# Altium schematic sheet USBC_Hub2.SchDoc
size A3; SheetNumber: 1; SheetTotal: 4
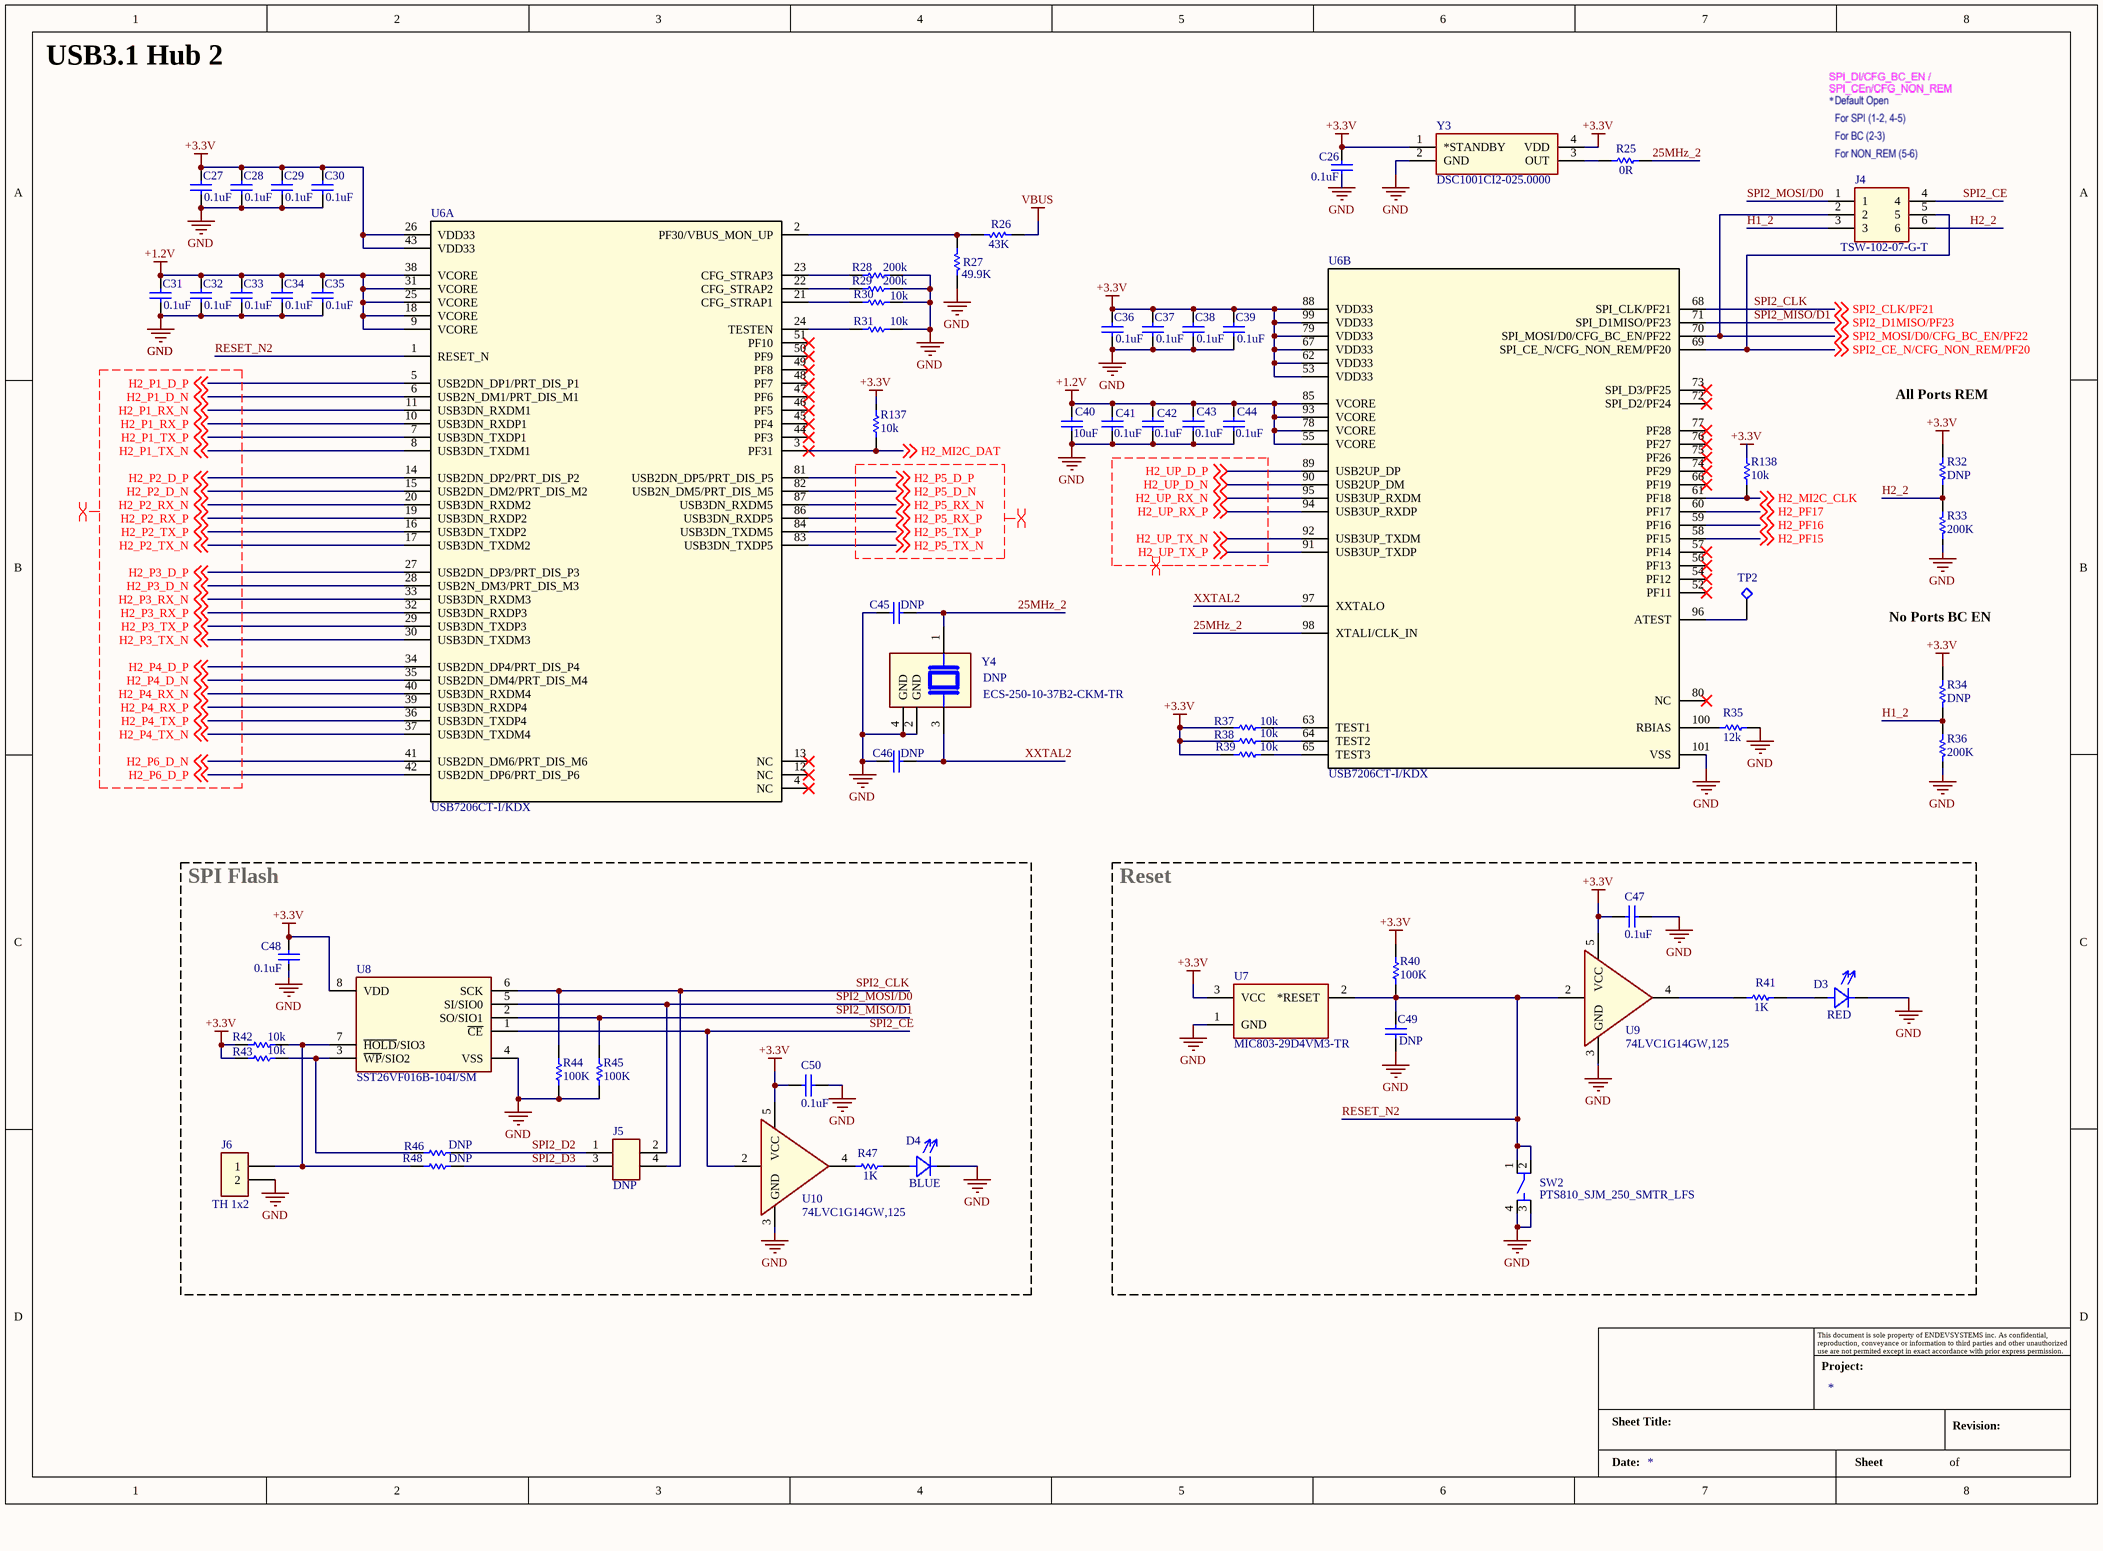
[diagram p0: USBC_Hub2.SchDoc]

## Parts
?  Title_Block  (value not drawn)  (graphical)
C26  0.1uF  [C-0402/1005]
C27  0.1uF  [C-0402/1005]
C28  0.1uF  [C-0402/1005]
C29  0.1uF  [C-0402/1005]
C30  0.1uF  [C-0402/1005]
C31  0.1uF  [C-0402/1005]
C32  0.1uF  [C-0402/1005]
C33  0.1uF  [C-0402/1005]
C34  0.1uF  [C-0402/1005]
C35  0.1uF  [C-0402/1005]
C36  0.1uF  [C-0402/1005]
C37  0.1uF  [C-0402/1005]
C38  0.1uF  [C-0402/1005]
C39  0.1uF  [C-0402/1005]
C40  10uF  [C-0805/2012]
C41  0.1uF  [C-0402/1005]
C42  0.1uF  [C-0402/1005]
C43  0.1uF  [C-0402/1005]
C44  0.1uF  [C-0402/1005]
C45  DNP  [R-0402/1005]
C46  DNP  [R-0402/1005]
C47  0.1uF  [C-0402/1005]
C48  0.1uF  [C-0402/1005]
C49  value DNP  [C-0402/1005]  (hidden comment: 0.1uF)
C50  0.1uF  [C-0402/1005]
D3  RED  [LEDC1608X65N]
D4  BLUE  [LEDC1608X65N]
J4  TSW-102-07-G-T  [CON6_3X2_TU_TSW_SAI]
J5  DNP  [PIN HEADER 2x2 2.54mm]
J6  TH 1x2  [PIN HEADER 1x2 2.54mm]
R25  0R  [R-0402/1005]
R26  43K  [R-0402/1005]
R27  49.9K  [R-0402/1005]
R28  200k  [R-0402/1005]
R29  200k  [R-0402/1005]
R30  10k  [R-0402/1005]
R31  10k  [R-0402/1005]
R32  DNP  [R-0402/1005]
R33  200K  [R-0402/1005]
R34  DNP  [R-0402/1005]
R35  12k  [R-0402/1005]
R36  200K  [R-0402/1005]
R37  10k  [R-0402/1005]
R38  10k  [R-0402/1005]
R39  10k  [R-0402/1005]
R40  100K  [R-0402/1005]
R41  1K  [R-0402/1005]
R42  10k  [R-0402/1005]
R43  10k  [R-0402/1005]
R44  100K  [R-0402/1005]
R45  100K  [R-0402/1005]
R46  DNP  [R-0402/1005]
R47  1K  [R-0402/1005]
R48  DNP  [R-0402/1005]
R137  10k  [R-0402/1005]
R138  10k  [R-0402/1005]
SW2  PTS810_SJM_250_SMTR_LFS  [SW_PTS810_SJM_250_SMTR_LFS]
TP2  Test Points  [Test Point TH Round H0.9,D1.6]  (value not drawn)
U6  USB7206CT-I/KDX  [USB7206]  (parts A,B of 2)
U7  MIC803-29D4VM3-TR  [SOT-23_M3_MCH]
U8  SST26VF016B-104I/SM  [SOIC127P794X203-8N]
U9  74LVC1G14GW,125  [SOT65P212X110-5N]
U10  74LVC1G14GW,125  [SOT65P212X110-5N]
Y3  DSC1001CI2-025.0000  [CDFN4_3P2X2P5_MCH]
Y4  DNP  [ECS-250-10-37B2]

## Blocks framed on the sheet
SPI Flash: C48 C50 D4 J5 J6 R42-R48 U8 U10
Reset: C47 C49 D3 R40 R41 SW2 U7 U9

## Nets
+1.2V: C31.2 C32.2 C33.2 C34.2 C35.2 C40.2 C41.1 C42.1 C43.2 C44.2 U6.9(VCORE) U6.18(VCORE) U6.25(VCORE) U6.31(VCORE) U6.38(VCORE) U6.55(VCORE) U6.78(VCORE) U6.85(VCORE) U6.93(VCORE)
+3.3V: C26.2 C27.2 C28.2 C29.2 C30.2 C36.2 C37.2 C38.2 C39.2 C47.2 C48.2 C50.2 R32.2 R34.2 R37.2 R38.2 R39.2 R40.1 R42.2 R43.2 R137.1 R138.1 U6.26(VDD33) U6.43(VDD33) U6.53(VDD33) U6.62(VDD33) U6.67(VDD33) U6.79(VDD33) U6.88(VDD33) U6.99(VDD33) U7.3(VCC) U8.8(VDD) U9.5(VCC) U10.5(VCC) Y3.1(*STANDBY) Y3.4(VDD)
GND: C26.1 C27.1 C28.1 C29.1 C30.1 C31.1 C32.1 C33.1 C34.1 C35.1 C36.1 C37.1 C38.1 C39.1 C40.1 C41.2 C42.2 C43.1 C44.1 C45.2 C46.2 C47.1 C48.1 C49.1 C50.1 D3.C D4.C J6.2 R27.2 R28.2 R29.2 R30.2 R31.1 R33.1 R35.1 R36.1 R44.2 R45.2 SW2.3 SW2.4 U6.101(VSS) U7.1(GND) U8.4(VSS) U9.3(GND) U10.3(GND) Y3.2(GND) Y4.2(GND) Y4.4(GND)
VBUS: R26.2
25MHz_2: C45.1 R25.2 U6.98(XTALI/CLK_IN) Y4.1
H1_2: J4.3 R34.1 R36.2
H2_2: J4.6 R32.1 R33.2
H2_MI2C_CLK: R138.2 U6.61(PF18) ; off-sheet H2_MI2C_CLK
H2_MI2C_DAT: R137.2 U6.3(PF31) ; off-sheet H2_MI2C_DAT
H2_P1_D_N: U6.6(USB2N_DM1/PRT_DIS_M1) ; off-sheet H2_P1_D_N
H2_P1_D_P: U6.5(USB2DN_DP1/PRT_DIS_P1) ; off-sheet H2_P1_D_P
H2_P1_RX_N: U6.11(USB3DN_RXDM1) ; off-sheet H2_P1_RX_N
H2_P1_RX_P: U6.10(USB3DN_RXDP1) ; off-sheet H2_P1_RX_P
H2_P1_TX_N: U6.8(USB3DN_TXDM1) ; off-sheet H2_P1_TX_N
H2_P1_TX_P: U6.7(USB3DN_TXDP1) ; off-sheet H2_P1_TX_P
H2_P2_D_N: U6.15(USB2DN_DM2/PRT_DIS_M2) ; off-sheet H2_P2_D_N
H2_P2_D_P: U6.14(USB2DN_DP2/PRT_DIS_P2) ; off-sheet H2_P2_D_P
H2_P2_RX_N: U6.20(USB3DN_RXDM2) ; off-sheet H2_P2_RX_N
H2_P2_RX_P: U6.19(USB3DN_RXDP2) ; off-sheet H2_P2_RX_P
H2_P2_TX_N: U6.17(USB3DN_TXDM2) ; off-sheet H2_P2_TX_N
H2_P2_TX_P: U6.16(USB3DN_TXDP2) ; off-sheet H2_P2_TX_P
H2_P3_D_N: U6.28(USB2N_DM3/PRT_DIS_M3) ; off-sheet H2_P3_D_N
H2_P3_D_P: U6.27(USB2DN_DP3/PRT_DIS_P3) ; off-sheet H2_P3_D_P
H2_P3_RX_N: U6.33(USB3DN_RXDM3) ; off-sheet H2_P3_RX_N
H2_P3_RX_P: U6.32(USB3DN_RXDP3) ; off-sheet H2_P3_RX_P
H2_P3_TX_N: U6.30(USB3DN_TXDM3) ; off-sheet H2_P3_TX_N
H2_P3_TX_P: U6.29(USB3DN_TXDP3) ; off-sheet H2_P3_TX_P
H2_P4_D_N: U6.35(USB2DN_DM4/PRT_DIS_M4) ; off-sheet H2_P4_D_N
H2_P4_D_P: U6.34(USB2DN_DP4/PRT_DIS_P4) ; off-sheet H2_P4_D_P
H2_P4_RX_N: U6.40(USB3DN_RXDM4) ; off-sheet H2_P4_RX_N
H2_P4_RX_P: U6.39(USB3DN_RXDP4) ; off-sheet H2_P4_RX_P
H2_P4_TX_N: U6.37(USB3DN_TXDM4) ; off-sheet H2_P4_TX_N
H2_P4_TX_P: U6.36(USB3DN_TXDP4) ; off-sheet H2_P4_TX_P
H2_P5_D_N: U6.82(USB2N_DM5/PRT_DIS_M5) ; off-sheet H2_P5_D_N
H2_P5_D_P: U6.81(USB2DN_DP5/PRT_DIS_P5) ; off-sheet H2_P5_D_P
H2_P5_RX_N: U6.87(USB3DN_RXDM5) ; off-sheet H2_P5_RX_N
H2_P5_RX_P: U6.86(USB3DN_RXDP5) ; off-sheet H2_P5_RX_P
H2_P5_TX_N: U6.83(USB3DN_TXDP5) ; off-sheet H2_P5_TX_N
H2_P5_TX_P: U6.84(USB3DN_TXDM5) ; off-sheet H2_P5_TX_P
H2_P6_D_N: U6.41(USB2DN_DM6/PRT_DIS_M6) ; off-sheet H2_P6_D_N
H2_P6_D_P: U6.42(USB2DN_DP6/PRT_DIS_P6) ; off-sheet H2_P6_D_P
H2_PF15: U6.58(PF15) ; off-sheet H2_PF15
H2_PF16: U6.59(PF16) ; off-sheet H2_PF16
H2_PF17: U6.60(PF17) ; off-sheet H2_PF17
H2_UP_D_N: U6.90(USB2UP_DM) ; off-sheet H2_UP_D_N
H2_UP_D_P: U6.89(USB2UP_DP) ; off-sheet H2_UP_D_P
H2_UP_RX_N: U6.95(USB3UP_RXDM) ; off-sheet H2_UP_RX_N
H2_UP_RX_P: U6.94(USB3UP_RXDP) ; off-sheet H2_UP_RX_P
H2_UP_TX_N: U6.92(USB3UP_TXDM) ; off-sheet H2_UP_TX_N
H2_UP_TX_P: U6.91(USB3UP_TXDP) ; off-sheet H2_UP_TX_P
RESET_N2: C49.2 R40.2 SW2.1 SW2.2 U6.1(RESET_N) U7.2(*RESET) U9.2(A)
SPI2_CE: J4.4 U8.1(~{CE}) U10.2(A)
SPI2_CE_N/CFG_NON_REM/PF20: J4.5 U6.69(SPI_CE_N/CFG_NON_REM/PF20) ; off-sheet SPI2_CE_N/CFG_NON_REM/PF20
SPI2_CLK: J5.4 R44.1 U6.68(SPI_CLK/PF21) U8.6(SCK) ; off-sheet SPI2_CLK/PF21  [also labelled SPI2_CLK/PF21]
SPI2_D2: J5.1 R46.2
SPI2_D3: J5.3 R48.2
SPI2_MISO/D1: R45.1 U6.71(SPI_D1MISO/PF23) U8.2(SO/SIO1) ; off-sheet SPI2_D1MISO/PF23  [also labelled SPI2_D1MISO/PF23]
SPI2_MOSI/D0: J4.1 J5.2 U8.5(SI/SIO0)
SPI2_MOSI/D0/CFG_BC_EN/PF22: J4.2 U6.70(SPI_MOSI/D0/CFG_BC_EN/PF22) ; off-sheet SPI2_MOSI/D0/CFG_BC_EN/PF22
XXTAL2: C46.1 U6.97(XXTALO) Y4.3
NetD3_A: D3.A R41.1
NetD4_A: D4.A R47.1
NetJ6_1: J6.1 R42.1 R48.1 U8.7(~{HOLD}/SIO3)
NetR25_1: R25.1 Y3.3(OUT)
NetR26_1: R26.1 R27.1 U6.2(PF30/VBUS_MON_UP)
NetR28_1: R28.1 U6.23(CFG_STRAP3)
NetR29_1: R29.1 U6.22(CFG_STRAP2)
NetR30_1: R30.1 U6.21(CFG_STRAP1)
NetR31_2: R31.2 U6.24(TESTEN)
NetR35_2: R35.2 U6.100(RBIAS)
NetR37_1: R37.1 U6.63(TEST1)
NetR38_1: R38.1 U6.64(TEST2)
NetR39_1: R39.1 U6.65(TEST3)
NetR41_2: R41.2 U9.4(~{Y})
NetR43_1: R43.1 R46.1 U8.3(~{WP}/SIO2)
NetTP2_1: TP2.1 U6.96(ATEST)

Not connected (* = marked no-connect by the designer): R47 2; U6 4(NC)* 12(NC)* 13(NC)* 44(PF3)* 45(PF4)* 46(PF5)* 47(PF6)* 48(PF7)* 49(PF8)* 50(PF9)* 51(PF10)* 52(PF11)* 54(PF12)* 56(PF13)* 57(PF14)* 66(PF19)* 72(SPI_D2/PF24)* 73(SPI_D3/PF25)* 74(PF29)* 75(PF26)* 76(PF27)* 77(PF28)* 80(NC)*; U10 4(~{Y})

## Layout directives
differential pair; differential pair class Diff_90R: H2_P1_D_N, H2_P1_D_P, H2_P1_RX_N, H2_P1_RX_P, H2_P1_TX_N, H2_P1_TX_P, H2_P2_D_N, H2_P2_D_P, H2_P2_RX_N, H2_P2_RX_P, H2_P2_TX_N, H2_P2_TX_P, H2_P3_D_N, H2_P3_D_P, H2_P3_RX_N, H2_P3_RX_P, H2_P3_TX_N, H2_P3_TX_P, H2_P4_D_N, H2_P4_D_P, H2_P4_RX_N, H2_P4_RX_P, H2_P4_TX_N, H2_P4_TX_P, H2_P5_D_N, H2_P5_D_P, H2_P5_RX_N, H2_P5_RX_P, H2_P5_TX_N, H2_P5_TX_P, H2_P6_D_N, H2_P6_D_P, H2_UP_D_N, H2_UP_D_P, H2_UP_RX_N, H2_UP_RX_P, H2_UP_TX_N, H2_UP_TX_P

## Notes on the sheet
- USB3.1 Hub 2
- All Ports REM
- No Ports BC EN
- (in symbol Title_Block) This document is sole property of ENDEVSYSTEMS inc. As confidential, reproduction, conveyance or information to third parties and other unauthorized use are not permited except in exact accordance with prior express permission.; Project:; Sheet Title:; Revision:; Date:; Sheet; of

## Library data of the parts
C26-C44 C47-C50 = Cap: Capacitor; Published: 8-Jun-2000; LatestRevisionDate: 17-Jul-2002; LatestRevisionNote: Re-released for DXP Platform.; PackageReference: RAD-0.3; Publisher: Altium Limited; PackageDescription: Radial Cap, Thru-Hole; 2 Leads; 0.3 in Pin Spacing
  C26-C39 C41-C44 C47 C48 C50: Value: 0.1uF
  C40: Value: 10uF
C45 C46 = Cap: Capacitor; Value: 0.1uF; Published: 8-Jun-2000; LatestRevisionDate: 17-Jul-2002; LatestRevisionNote: Re-released for DXP Platform.; PackageReference: RAD-0.3; Publisher: Altium Limited; PackageDescription: Radial Cap, Thru-Hole; 2 Leads; 0.3 in Pin Spacing
D3 D4 = Diode-LED: Supplier: Digikey Electronics
J4 = TSW-102-07-G-T: No Description Available; Mfr_Name: Samtec Inc; Copyright: Copyright (C) 2023 Ultra Librarian. All rights reserved.; Manufacturer_Part_Number: TSW-102-07-G-T; Digi-Key_Part_Number_1: TSW-102-07-G-T-ND; RefDes: RefDes; Type: DEV
J5 = Header 2x2: FIXED IND 22UH 620MA 350 MOHM; Mfr. Part No.: PH2-04-UA; Unit Price (USD): 0.1; Supplier Part No.: 2057-PH2-04-UA-ND; Supplier: Digikey Electronics
J6 = Header 1x2: CONN HEADER VERT 3POS 2.54MM; Mfr. Part No.: 75160-156-03LF; Value: 51R; Unit Price (USD): 0.74; Supplier Part No.: 609-75160-156-03LF-ND; Supplier: Digikey Electronics
R25 R46 R48 = Res1: Resistor; Value: 200K; Published: 8-Jun-2000; LatestRevisionDate: 17-Jul-2002; LatestRevisionNote: Re-released for DXP Platform.; PackageReference: AXIAL-0.3; Publisher: Altium Limited; PackageDescription: Axial Device, Thru-Hole; 2 Leads; 0.3 in Pin Spacing
R26 R27 R32-R36 R40 R41 R44 R45 R47 = Res1: Resistor; Value: 10K; Published: 8-Jun-2000; LatestRevisionDate: 17-Jul-2002; LatestRevisionNote: Re-released for DXP Platform.; PackageReference: AXIAL-0.3; Publisher: Altium Limited; PackageDescription: Axial Device, Thru-Hole; 2 Leads; 0.3 in Pin Spacing
R28-R31 R37-R39 R42 R43 R137 R138 = Res1: Resistor; Published: 8-Jun-2000; LatestRevisionDate: 17-Jul-2002; LatestRevisionNote: Re-released for DXP Platform.; PackageReference: AXIAL-0.3; Publisher: Altium Limited; PackageDescription: Axial Device, Thru-Hole; 2 Leads; 0.3 in Pin Spacing
  R28 R29: Value: 200K
  R30 R31 R37-R39 R42 R43 R137 R138: Value: 10K
SW2 = PTS810_SJM_250_SMTR_LFS: Tactile Switch SPST-NO Top Actuated Surface Mount; MF: C&K; MP: PTS810 SJM 250 SMTR LFS; Price: None; Package: None; Availability: Unavailable; Value: *; SnapEDA_Link: https://www.snapeda.com/parts/PTS810%20SJM%20250%20SMTR%20LFS/C%26K/view-part/522770/?ref=snap
U6 = USB7206: IC USB3.1 GEN2 HUB TYPE C; Manufacturer: Microchip Technology; Manufacturer Product Number: USB7206CT-I/KDX; Digi-Key Part Number: 150-USB7206CT-I/KDXTR-ND; Unit Price: $12.9; Stock: 4935
U7 = MIC803-29D4VM3-TR: No Description Available; Mfr_Name: Microchip; Copyright: Copyright (C) 2023 Ultra Librarian. All rights reserved.; Manufacturer_Part_Number: MIC803-29D4VM3-TR; Digi-Key_Part_Number_1: 576-3806-1-ND; Digi-Key_Part_Number_2: 576-3806-2-ND; Digi-Key_Part_Number_3: 576-3806-6-ND; RefDes: RefDes; Type: DEV
U9 U10 = 74LVC1G14GW,125: Inverter Schmitt Trigger 1-Element CMOS 5-Pin TSSOP T/R; Price: None; Availability: Unavailable; MP: 74LVC1G14GW,125; Value: *; Package: None
Y3 = DSC1001CI2-025.0000: No Description Available; Mfr_Name: Microchip; Copyright: Copyright (C) 2023 Ultra Librarian. All rights reserved.; Manufacturer_Part_Number: DSC1001CI2-025.0000; Digi-Key_Part_Number_1: 576-4957-5-ND; RefDes: RefDes; Type: DEV
Y4 = ECS-250-10-37B2-CKM-TR: Parameter 1: ECS-250-10-37B2-CKM-TR
? = Title_Block: Date:: *; Project:: *